# Altium schematic sheet GPI.SchDoc
size A4; SheetNumber: 6; SheetTotal: 8
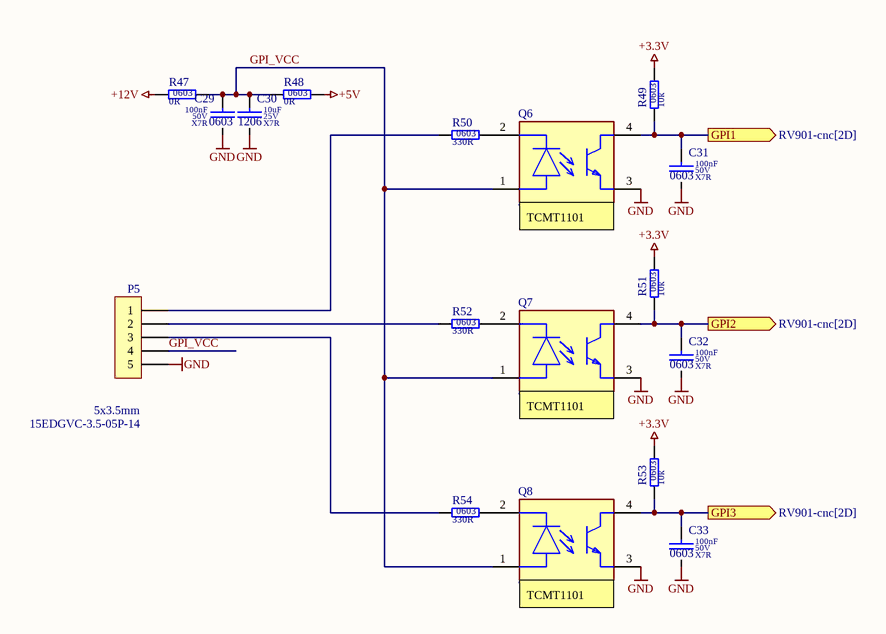
[diagram p0: GPI.SchDoc]

## Parts
C29  value 100nF  Dielectric: X7R  Voltage: 50V  SCH_Footprint: 0603  [C_0603_1608]  (hidden comment: Ceramic X7R)
C30  value 10uF  Dielectric: X7R  Voltage: 25V  SCH_Footprint: 1206  [C_1206_3216]  (hidden comment: Ceramic X7R)
C31  value 100nF  Dielectric: X7R  Voltage: 50V  SCH_Footprint: 0603  [C_0603_1608]  (hidden comment: Ceramic X7R)
C32  value 100nF  Dielectric: X7R  Voltage: 50V  SCH_Footprint: 0603  [C_0603_1608]  (hidden comment: Ceramic X7R)
C33  value 100nF  Dielectric: X7R  Voltage: 50V  SCH_Footprint: 0603  [C_0603_1608]  (hidden comment: Ceramic X7R)
P5  value 15EDGVC-3.5-05P-14  SCH_Footprint: 5x3.5mm  [P_15EDGVC-3.5-05P]  (hidden comment: 5-pin 3.5mm terminal block)
Q6  TCMT1106  [FP-TCMT1106-MFG]
Q7  TCMT1106  [FP-TCMT1106-MFG]
Q8  TCMT1106  [FP-TCMT1106-MFG]
R47  value 0R  SCH_Footprint: 0603  [R_0603_1608]  (hidden comment: Resistor)
R48  value 0R  SCH_Footprint: 0603  [R_0603_1608]  (hidden comment: Resistor)
R49  value 10k  SCH_Footprint: 0603  [R_0603_1608]  (hidden comment: Resistor)
R50  value 330R  SCH_Footprint: 0603  [R_0603_1608]  (hidden comment: Resistor)
R51  value 10k  SCH_Footprint: 0603  [R_0603_1608]  (hidden comment: Resistor)
R52  value 330R  SCH_Footprint: 0603  [R_0603_1608]  (hidden comment: Resistor)
R53  value 10k  SCH_Footprint: 0603  [R_0603_1608]  (hidden comment: Resistor)
R54  value 330R  SCH_Footprint: 0603  [R_0603_1608]  (hidden comment: Resistor)

## Ports
GPI1 (out, see RV901-cnc[2D]), GPI2 (out, see RV901-cnc[2D]), GPI3 (out, see RV901-cnc[2D])

## Nets
+3.3V: R49.2 R51.2 R53.2
+5V: R48.2
+12V: R47.1
GND: C29.2 C30.2 C31.2 C32.2 C33.2 P5.5 Q6.3(E) Q7.3(E) Q8.3(E)
GPI1: C31.1 Q6.4(C) R49.1 ; port GPI1
GPI2: C32.1 Q7.4(C) R51.1 ; port GPI2
GPI3: C33.1 Q8.4(C) R53.1 ; port GPI3
GPI_VCC: C29.1 C30.1 P5.4 Q6.1(A) Q7.1(A) Q8.1(A) R47.2 R48.1
NetP5_1: P5.1 R50.1
NetP5_2: P5.2 R52.1
NetP5_3: P5.3 R54.1
NetQ6_2: Q6.2(C) R50.2
NetQ7_2: Q7.2(C) R52.2
NetQ8_2: Q8.2(C) R54.2

## Notes on the sheet
- (near Q6) TCMT1101
- (near Q7) TCMT1101
- (near Q8) TCMT1101

## Library data of the parts
C29 C31-C33 = C_100nF_50V_X7R_0603_5: Capacitor; Manufacturer: Samsung; Manufacturer Part Number: CL10B104JB8NNNC; Tolerance (%): 5; Part Number: C_100nF_50V_X7R_0603_5; HelpURL: http://www.tme.eu/pl/Document/4a42202b32dab16128fe107dd69598cc/samsung-chip-cap.pdf; Supplier 1: TME; Supplier Part Number 1: CL10B104JB8NNNC; Supplier 2: RS Components; Supplier Part Number 2: 7665455; Supplier 3: Farnell; Supplier 4: Mouser; Supplier 5: Digi-Key; Supplier Part Number 5: 1276-1033-1-ND; Supplier 6: LCSC; Supplier Part Number 6: C24452
C30 = C_10uF_25V_X7R_1206_10: Capacitor; Manufacturer: Samsung; Manufacturer Part Number: CL31B106KAHNNNE; Tolerance (%): 10; Part Number: C_10uF_25V_X7R_1206_10; HelpURL: http://www.tme.eu/pl/Document/4a42202b32dab16128fe107dd69598cc/samsung-chip-cap.pdf; Supplier 1: TME; Supplier Part Number 1: CL31B106KAHNNNE; Supplier 2: RS Components; Supplier Part Number 2: 766-6773; Supplier 3: Farnell; Supplier Part Number 3: 3013526; Supplier 4: Mouser; Supplier Part Number 4: 187-CL31B106KAHNNNE; Supplier 5: Digi-Key; Supplier Part Number 5: 1276-1804-1-ND; Supplier 6: LCSC
P5 = P_15EDGVC-3.5-05P-14: Pin Header; Manufacturer: DEGSON ELECTRONICS; Part Number: P_15EDGVC-3.5-05P-14; HelpURL: https://www.tme.eu/Document/83e7173fe653a2d0e44585e87978945b/opr014R8.pdf; Manufacturer Part Number: 15EDGVC-3.5-05P-14; Supplier 1: TME; Supplier 2: RS Components; Supplier 3: Farnell; Supplier 4: Mouser; Supplier 5: Digi-Key; Supplier 6: LCSC; Supplier Part Number 6: C7603430; Supplier 7: Conrad; Supplier Part Number 7: 1327356
Q6-Q8 = CMP-00030-39642376-1: TCMT1106 TCMT1106 Vishay Transistor Output Optocouplers Phototransistor Out 3750Vrms1 Channel 4-SOP RoHS; Current Transfer Ratio: 300%; Reverse Voltage: 6V; Number of Channels: 1; Turn-Off Delay Time: 8.5µs; Power Dissipation: 250mW; Output Current per Channel: 50mA; Voltage Rating (DC): 70V; Forward Current: 60mA; Turn-On Delay Time: 9.5µs; Rise Time: 3s; Isolation Voltage: 3.75kV; Fall Time: 4.7s; Max Junction Temperature (Tj): 125°C; Collector Emitter Saturation Voltage: 300mV; Forward Voltage: 1.35V; Ambient Temperature Range High: 100°C; Height: 2.3mm; Mount: PCB, Surface Mount; Max Operating Temperature: 100°C; Radiation Hardening: No; RoHS: Compliant; Min Operating Temperature: -40°C; NexarPartId: 39642376; Number of Pins: 4; Output Voltage: 70V; Max Output Voltage: 70V; Reverse Breakdown Voltage: 6V; Voltage: 6V; Collector Emitter Voltage (VCEO): 70V; Number of Elements: 1; Max Collector Current: 50mA; Schedule B: 8541408000, 8541408000; Input Current: 50mA; Max Power Dissipation: 250mW; Packaging: Tape and Reel; Max Input Current: 60mA; Case/Package: SOP; Lead Free: Lead Free; REACH SVHC: Unknown
R47 R48 = R_0R_0603_1: Manufacturer: Yageo; Manufacturer Part Number: RC0603FR-070RL; Voltage: 75V; Power: 100mW; Tolerance: 1%; Part Number: R_0R_0603_1; HelpURL: https://datasheet.octopart.com/RC0603FR-070RL-Yageo-datasheet-8328172.pdf; Supplier 1: TME; Supplier Part Number 1: RC0603FR-070RL; Supplier 2: RS Components; Supplier 3: Farnell; Supplier Part Number 3: 2309106; Supplier 4: Mouser; Supplier Part Number 4: 603-RC0603FR-070RL; Supplier 5: Digi-Key; Supplier Part Number 5: 311-0.0HRCT-ND; Supplier 6: LCSC; Supplier Part Number 6: C100044
R49 R51 R53 = R_10k_0603_1_AECQ0: Manufacturer: Panasonic; Manufacturer Part Number: ERJ-3EKF1002V; Voltage: 75V; Power: 100mW; Tolerance: 1%; AEC-Q: 0; Part Number: R_10k_0603_1_AECQ0; HelpURL: https://industrial.panasonic.com/cdbs/www-data/pdf/RDA0000/AOA0000C304.pdf; Supplier 1: TME; Supplier Part Number 1: ERJ3EKF1002V; Supplier 2: RS Components; Supplier 3: Farnell; Supplier Part Number 3: 2303192; Supplier 4: Mouser; Supplier Part Number 4: 667-ERJ-3EKF1002V; Supplier 5: Digi-Key; Supplier Part Number 5: P10.0KHCT-ND; Supplier 6: LCSC; Supplier Part Number 6: C191124
R50 R52 R54 = R_330R_0603_1: Manufacturer: Yageo; Manufacturer Part Number: RC0603FR-07330RL; Voltage: 50V; Power: 100mW; Tolerance: 1%; Part Number: R_330R_0603_1; HelpURL: http://datasheet.octopart.com/RC0603FR-07330RL-Yageo-datasheet-8328172.pdf; Supplier 1: TME; Supplier Part Number 1: RC0603FR-07330R; Supplier 2: RS Components; Supplier Part Number 2: 5046499; Supplier 3: Farnell; Supplier Part Number 3: 9238425; Supplier 4: Mouser; Supplier Part Number 4: 603-RC0603FR-07330RL; Supplier 5: Digi-Key; Supplier Part Number 5: 311-330HRCT-ND; Supplier 6: LCSC